# EAGLE design sensor_module (EAGLE 9.6.1)
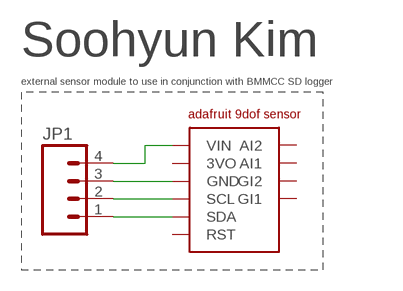
[diagram p0: schematic, sheet 1]

## Parts
JP1  M04  [1X04]
U$1  ADAFRUIT_9DOF  [9DOF_SENSOR]

## Nets
3V3: JP1.4 U$1.VIN
GND: JP1.3 U$1.GND
SCL: JP1.2 U$1.SCL
SDA: JP1.1 U$1.SDA
Unconnected: U$1.3VO U$1.AI1 U$1.AI2 U$1.GI1 U$1.GI2 U$1.RST

## Notes on the sheet
- Soohyun Kim
- external sensor module to use in conjunction with BMMCC SD logger
- adafruit 9dof sensor

## Library data of the parts
JP1 = HyTechDevices:M04: Standard 4-pin 0.1" header. NOTES ON THE VARIANTS LOCK and LOCK_LONGPADS... This footprint was designed to help hold the alignment of a through-hole component (i.e. 6-pin header) while soldering it into place. You may notice that each hole has been shifted either up or down by 0.005 of an inch from it's more standard position (which is a perfectly straight line). This slight alteration caused the pins (the squares in the middle) to touch the edges of the holes. Because they are alternating, it causes a "brace" to hold the component in place. 0.005 has proven to be the perfect amount of "off-center" position when using our standard breakaway headers. Although looks a little odd when you look at the bare footprint, once you have a header in there, the alteration is very hard to notice. Also,if you push a header all the way into place, it is covered up entirely on the bottom side. This idea of altering the position of holes to aid alignment will be further integrated into the Sparkfun Library for other footprints. It can help hold any component with 3 or more connection pins. Note: The Sparkfun version includes many other packages including surface mount that may be of future interest. Source: Sparkfun <https://github.com/sparkfun/SparkFun-Eagle-Libraries>
U$1 = HyTechDevices:ADAFRUIT_9DOF

## Board
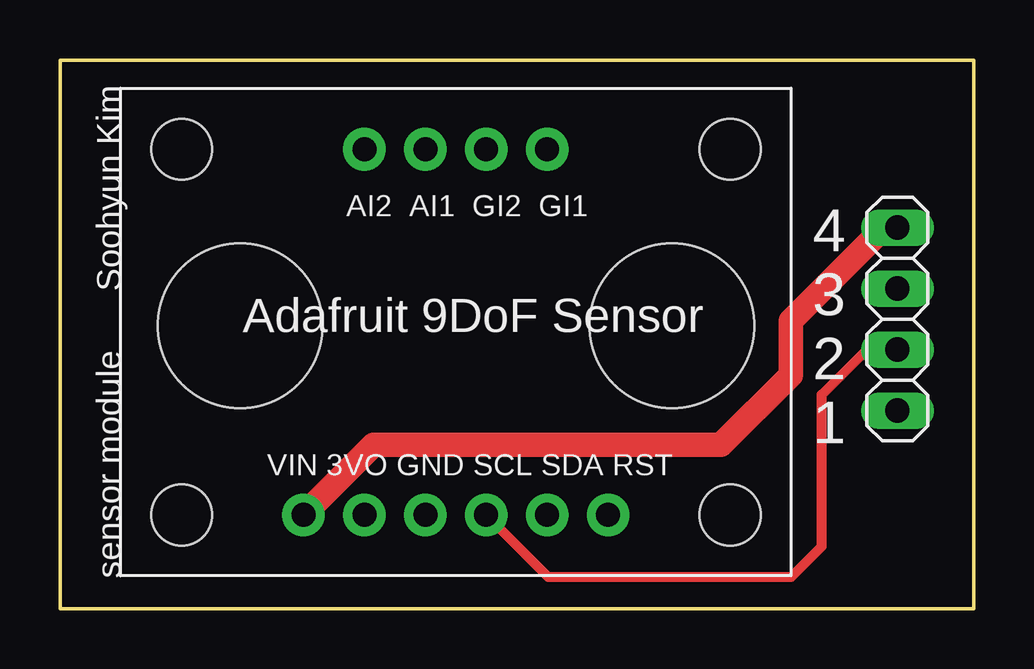
[diagram p1: board, top side]
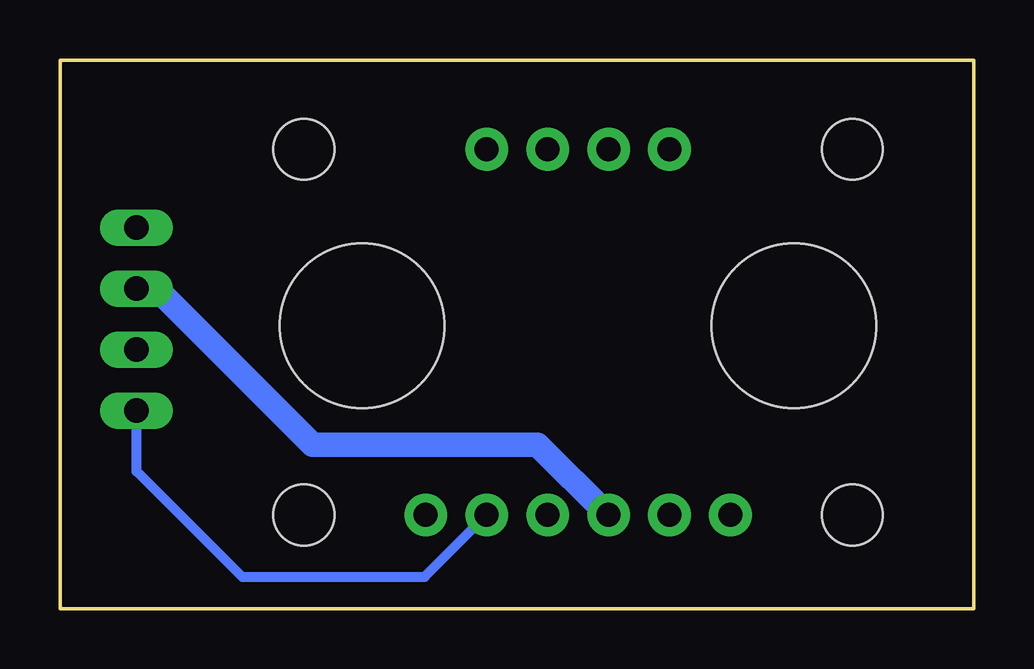
[diagram p2: board, bottom side, seen from below]

Size 38.1 x 22.86 mm. Coordinates in mm from the lower left corner, seen from the top.
Outline: 0,22.86 0,0 38.1,0 38.1,22.86 0,22.86
Copper layers (1*16): Top 0.035mm / dielectric 1.5mm / Bottom 0.035mm
Design rules "default *": minimum track width 6mil, minimum drill 0.35mm, track to track 15mil, track to pad 15mil, pad to pad 15mil, via to via 15mil, smd to smd 6mil, copper to edge 40mil, drill to drill 6mil, minimum pad ring 10mil, minimum via ring 8mil, stop-mask expansion 4mil, vias tented up to drill 0mil, thermal gap 10mil
Holes 6.86 mm at 7.51,11.79 25.51,11.79

### Footprints (pad centres in the part's own frame; a part is rotated, then mirrored left to right if it is on the bottom)
1X04 = drill 1.016 long: 1 -3.81,0; 2 -1.27,0; 3 1.27,0; 4 3.81,0
9DOF_SENSOR = drill 1 pad 1.778: 3VO 10.16,-17.78; AI1 12.7,-2.54; AI2 10.16,-2.54; GI1 17.78,-2.54; GI2 15.24,-2.54; GND 12.7,-17.78; RST 20.32,-17.78; SCL 15.24,-17.78; SDA 17.78,-17.78; VIN 7.62,-17.78 | hole 2.54: 25.4,-17.78; 25.4,-2.54; 2.54,-2.54; 2.54,-17.78

### Placement (x,y rotation side)
JP1  34.91,12.07 90 top
U$1  2.53,21.68 0 top

### Tracks (layer width: path | path; a pad name or v marks a point on that pad's centre or on a via)
3V3
  Top 1.016: JP1.4 34.35,15.88 30.46,11.99 30.46,9.73 27.56,6.83 13.08,6.83 U$1.VIN
GND
  Bottom 1.016: U$1.GND 15.26,3.9 18.19,6.83 27.56,6.83 34.06,13.33 JP1.3
SCL
  Top 0.406: U$1.SCL 20.35,1.32 30.48,1.32 31.75,2.59 31.75,8.91 33.63,10.79 JP1.2
SDA
  Bottom 0.406: JP1.1 34.91,5.72 30.5,1.32 22.89,1.32 U$1.SDA

### Text on the board
tNames: Soohyun Kim | 4 / 3 / 2 / 1 | sensor module